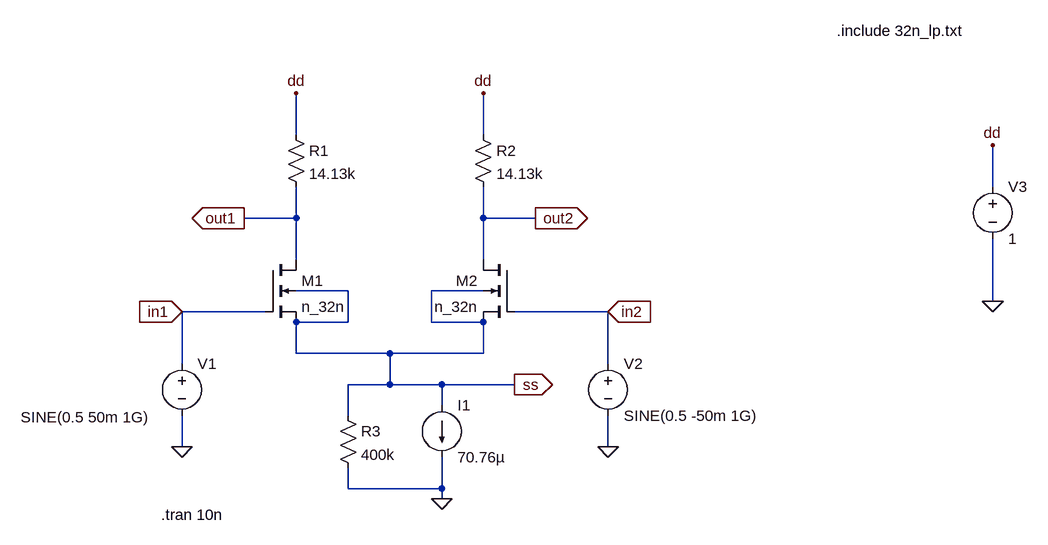
[diagram p0: schematic 32nm_diff.asc]
32nm_diff.asc, the LTspice schematic file:
Version 4
SHEET 1 1000 680
WIRE -128 -80 -128 -144
WIRE 160 -80 160 -144
WIRE 944 0 944 -64
WIRE -128 48 -128 0
WIRE -128 48 -208 48
WIRE 160 48 160 0
WIRE 240 48 160 48
WIRE -128 112 -128 48
WIRE 160 112 160 48
WIRE -48 160 -128 160
WIRE 160 160 80 160
WIRE 944 176 944 80
WIRE -176 192 -304 192
WIRE 352 192 208 192
WIRE -48 208 -48 160
WIRE -48 208 -128 208
WIRE 80 208 80 160
WIRE 160 208 80 208
WIRE -128 256 -128 208
WIRE 16 256 -128 256
WIRE 160 256 160 208
WIRE 160 256 16 256
WIRE -304 272 -304 192
WIRE 352 272 352 192
WIRE 16 304 16 256
WIRE 16 304 -48 304
WIRE 96 304 16 304
WIRE 208 304 96 304
WIRE 96 336 96 304
WIRE -48 352 -48 304
WIRE -304 400 -304 352
WIRE 352 400 352 352
WIRE -48 464 -48 432
WIRE 96 464 96 416
WIRE 96 464 -48 464
WIRE 96 480 96 464
FLAG 96 480 0
FLAG 352 400 0
FLAG -304 400 0
FLAG 160 -144 dd
FLAG -128 -144 dd
FLAG 944 176 0
FLAG 944 -64 dd
FLAG 208 304 ss
IOPIN 208 304 Out
FLAG 240 48 out2
IOPIN 240 48 Out
FLAG -208 48 out1
IOPIN -208 48 Out
FLAG -304 192 in1
IOPIN -304 192 In
FLAG 352 192 in2
IOPIN 352 192 In
SYMBOL nmos4 -176 112 R0
SYMATTR InstName M1
SYMATTR Value n_32n
SYMATTR Value2 l=96n w=1.8u
SYMBOL nmos4 208 112 M0
SYMATTR InstName M2
SYMATTR Value n_32n
SYMATTR Value2 l=96n w=1.8u
SYMBOL current 96 336 R0
WINDOW 123 0 0 Left 0
WINDOW 39 0 0 Left 0
SYMATTR InstName I1
SYMATTR Value 70.76µ
SYMBOL voltage -304 256 R0
WINDOW 3 -248 98 Left 2
WINDOW 123 0 0 Left 0
WINDOW 39 0 0 Left 0
SYMATTR Value SINE(0.5 50m 1G)
SYMATTR InstName V1
SYMBOL voltage 352 256 R0
WINDOW 123 0 0 Left 0
WINDOW 39 0 0 Left 0
SYMATTR InstName V2
SYMATTR Value SINE(0.5 -50m 1G)
SYMBOL res -144 -96 R0
SYMATTR InstName R1
SYMATTR Value 14.13k
SYMBOL res 144 -96 R0
SYMATTR InstName R2
SYMATTR Value 14.13k
SYMBOL voltage 944 -16 R0
WINDOW 123 0 0 Left 0
WINDOW 39 0 0 Left 0
SYMATTR InstName V3
SYMATTR Value 1
SYMBOL res -64 336 R0
SYMATTR InstName R3
SYMATTR Value 400k
TEXT 704 -240 Left 2 !.include 32n_lp.txt
TEXT -336 504 Left 2 !.tran 10n

The netlist it stands for:
* 32nm_diff.asc
M1 out1 in1 ss ss n_32n l=96n w=1.8u
M2 out2 in2 ss ss n_32n l=96n w=1.8u
I1 ss 0 70.76µ
V1 in1 0 SINE(0.5 50m 1G)
V2 in2 0 SINE(0.5 -50m 1G)
R1 dd out1 14.13k
R2 dd out2 14.13k
V3 dd 0 1
R3 ss 0 400k
.model NMOS NMOS
.model PMOS PMOS
.lib standard.mos
.include 32n_lp.txt
.tran 10n
.backanno
.end

* Results of the author's LTspice run, read from the files saved beside the schematic
* Operating Point, zero values left out:
*   V(out1) = 503.6 mV
*   V(in1) = 500 mV
*   V(ss) = -197.1 mV
*   V(out2) = 503.6 mV
*   V(in2) = 500 mV
*   V(dd) = 1 V
*   Id(M2) = 35.13 µA
*   Ig(M2) = 88.89 pA
*   Is(M2) = -35.13 µA
*   Id(M1) = 35.13 µA
*   Ig(M1) = 88.89 pA
*   Is(M1) = -35.13 µA
*   I(I1) = 70.76 µA
*   I(R3) = -492.7 nA
*   I(R2) = 35.13 µA
*   I(R1) = 35.13 µA
*   I(V3) = -70.27 µA
*   I(V2) = -88.89 pA
*   I(V1) = -88.89 pA
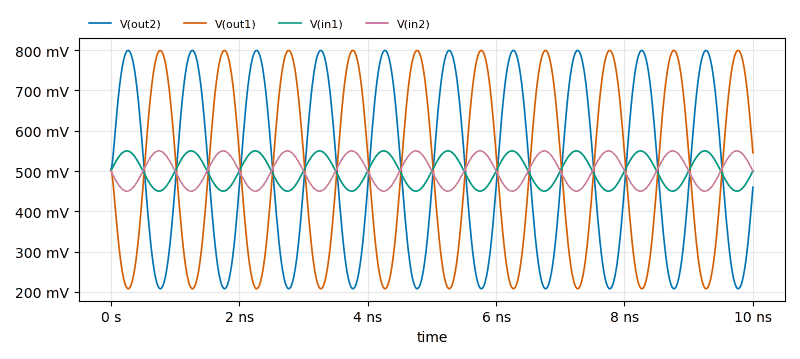
[diagram p1: Transient Analysis of 32nm_diff.asc, plotted from the saved traces]
* Transient Analysis, 1 run:
*   V(out2): min 207.7 mV, max 799.4 mV, average 503.6 mV, rms 547.1 mV, last 459.6 mV
*   V(out1): min 207.7 mV, max 799.4 mV, average 503.4 mV, rms 546.9 mV, last 545.2 mV
*   V(in1): min 450 mV, max 550 mV, average 500 mV, rms 501.2 mV, last 500 mV
*   V(in2): min 450 mV, max 550 mV, average 500 mV, rms 501.2 mV, last 500 mV